# Altium project WIRING.PrjPcb
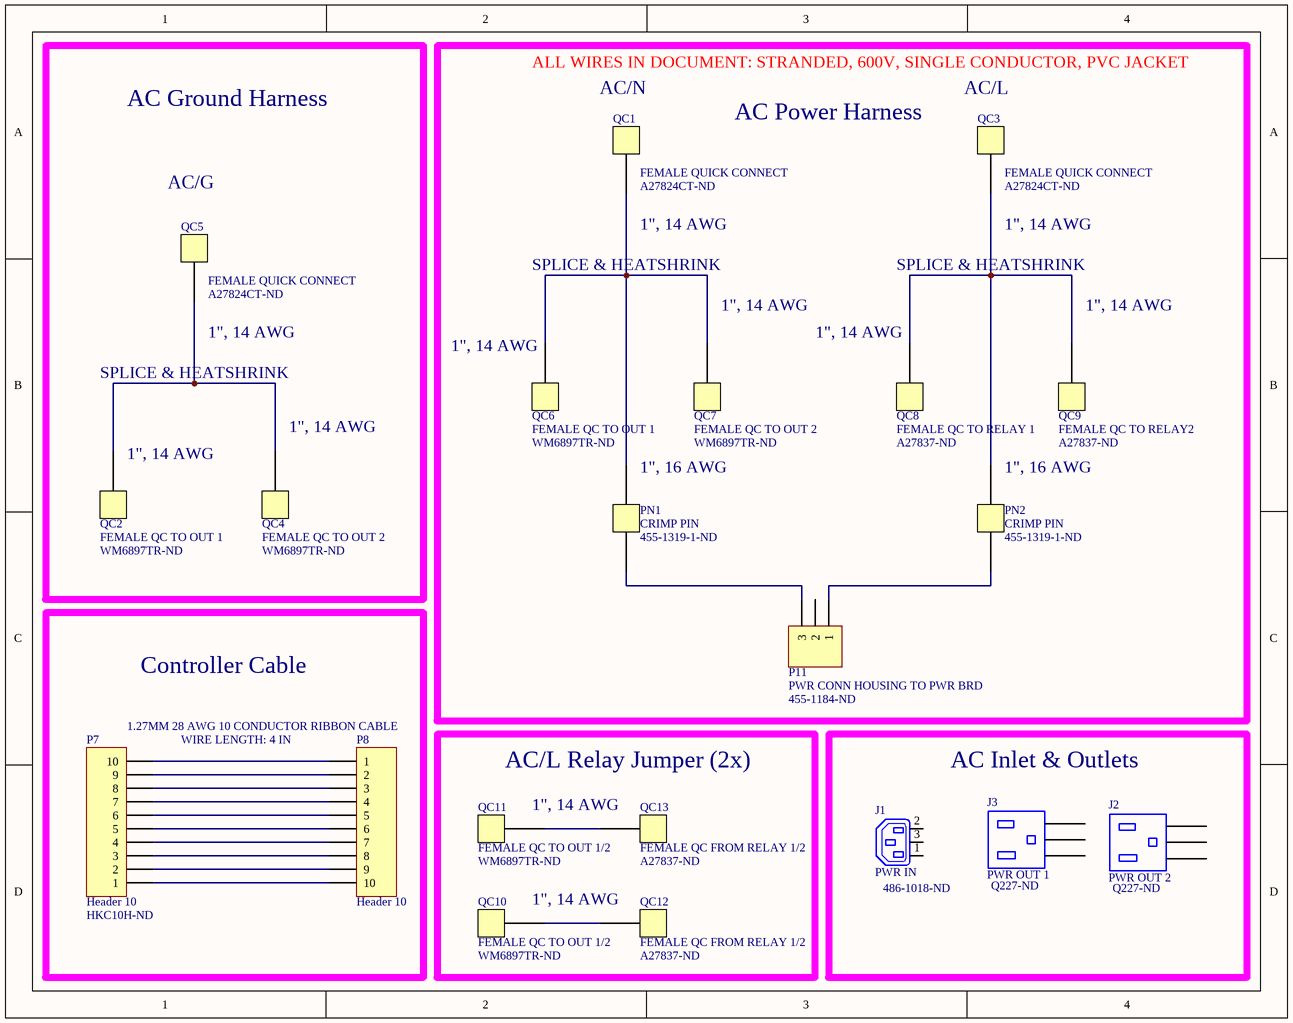
[diagram p0: WIRING.SchDoc]
1 sheet, 21 parts. Net scope: global (net labels, ports and power ports of the same name join across sheets).

## Sheet WIRING.SchDoc: BrewBit Model T Wiring Harnesses
size A

### Parts
J1  PWR IN  Supplier Part Number 1: 486-1018-ND  [IEC7-2H3]
J2  PWR OUT 2  Supplier Part Number 1: Q227-ND
J3  PWR OUT 1  Supplier Part Number 1: Q227-ND
P7  Header 10  Supplier Part Number 1: HKC10H-ND
P8  Header 10
P11  PWR CONN HOUSING TO PWR BRD  Supplier Part Number 1: 455-1184-ND
PN1  CRIMP PIN  Supplier Part Number 1: 455-1319-1-ND
PN2  CRIMP PIN  Supplier Part Number 1: 455-1319-1-ND
QC1  FEMALE QUICK CONNECT  Supplier Part Number 1: A27824CT-ND
QC2  FEMALE QC TO OUT 1  Supplier Part Number 1: WM6897TR-ND
QC3  FEMALE QUICK CONNECT  Supplier Part Number 1: A27824CT-ND
QC4  FEMALE QC TO OUT 2  Supplier Part Number 1: WM6897TR-ND
QC5  FEMALE QUICK CONNECT  Supplier Part Number 1: A27824CT-ND
QC6  FEMALE QC TO OUT 1  Supplier Part Number 1: WM6897TR-ND
QC7  FEMALE QC TO OUT 2  Supplier Part Number 1: WM6897TR-ND
QC8  FEMALE QC TO RELAY 1  Supplier Part Number 1: A27837-ND
QC9  FEMALE QC TO RELAY2  Supplier Part Number 1: A27837-ND
QC10  FEMALE QC TO OUT 1/2  Supplier Part Number 1: WM6897TR-ND
QC11  FEMALE QC TO OUT 1/2  Supplier Part Number 1: WM6897TR-ND
QC12  FEMALE QC FROM RELAY 1/2  Supplier Part Number 1: A27837-ND
QC13  FEMALE QC FROM RELAY 1/2  Supplier Part Number 1: A27837-ND

### Blocks framed on the sheet
AC Ground Harness: QC2 QC4 QC5
AC Power Harness: P11 PN1 PN2 QC1 QC3 QC6-QC9
Controller Cable: P7 P8
AC/L Relay Jumper (2x): QC10-QC13
AC Inlet & Outlets: J1-J3

### Nets
NetP7_1: P7.1 P8.10
NetP7_2: P7.2 P8.9
NetP7_3: P7.3 P8.8
NetP7_4: P7.4 P8.7
NetP7_5: P7.5 P8.6
NetP7_6: P7.6 P8.5
NetP7_7: P7.7 P8.4
NetP7_8: P7.8 P8.3
NetP7_9: P7.9 P8.2
NetP7_10: P7.10 P8.1
NetP11_1: P11.1 PN2.?2
NetP11_3: P11.3 PN1.?2
NetPN1_?1: PN1.?1 QC1.?1 QC6.?1 QC7.?1
NetPN2_?1: PN2.?1 QC3.?1 QC8.?1 QC9.?1
NetQC2_?1: QC2.?1 QC4.?1 QC5.?1
NetQC10_?1: QC10.?1 QC12.?1
NetQC11_?1: QC11.?1 QC13.?1

Not connected (* = marked no-connect by the designer): J1 1(L) 2(N) 3(E); J2 ?1 ?2 ?3; J3 ?1 ?2 ?3; P11 2

### Notes on the sheet
- ALL WIRES IN DOCUMENT: STRANDED, 600V, SINGLE CONDUCTOR, PVC JACKET
- AC/N
- AC/L
- AC/G
- 1", 14 AWG
- SPLICE & HEATSHRINK
- (near QC6) 1", 14 AWG
- (near QC8) 1", 14 AWG
- (near QC2) 1", 14 AWG
- (near PN1) 1", 16 AWG
- (near PN2) 1", 16 AWG
- 1.27MM 28 AWG 10 CONDUCTOR RIBBON CABLE
- WIRE LENGTH: 4 IN

### Library data of the parts
J1 = Plug AC Female: IEC Mains Power Outlet, EN60 320-2-2 F Class I, PC Flange Rear Mount, Chassis Socket; Supplier 1: Digi-Key
J2 J3 = PWR OUTLET: Supplier 1: Digi-Key
P7 P8 = Header 10: Header, 10-Pin; Supplier 1: Digi-Key
  P8: Supplier Part Number 1: HKC10H-ND
P11 = Header 3: POWER CONNECTOR HOUSING; Supplier 1: Digi-Key
QC1-QC13 = QUICK CONNECT: Supplier 1: Digi-Key
PN1 PN2 = CRIMP PIN: Supplier 1: Digi-Key